# EAGLE design coomu (EAGLE 9.6.2)
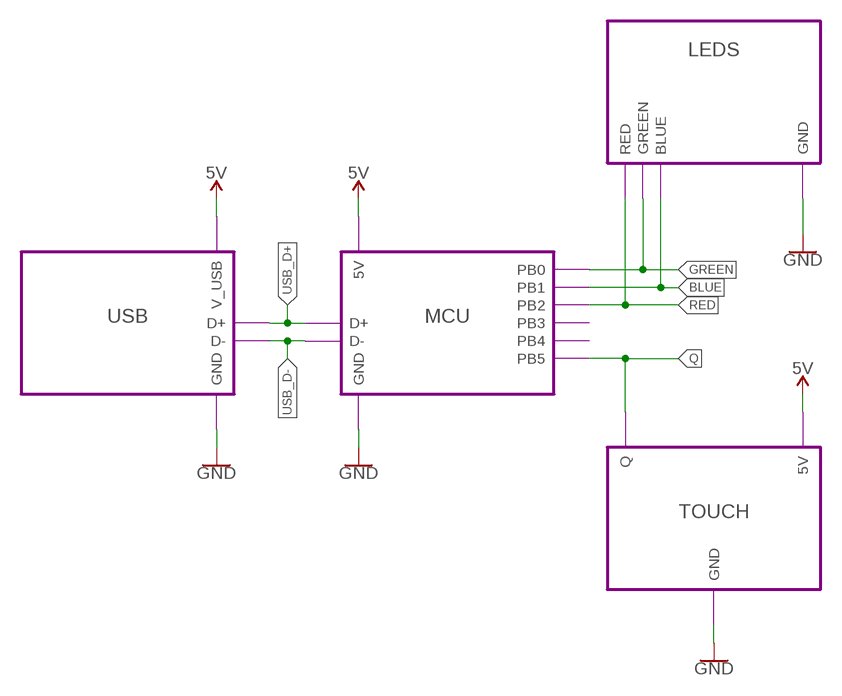
[diagram p0: schematic, sheet 1]

## Module instances
USB = USB
MCU = MCU
LEDS = LEDS
TOUCH = TOUCH

## Nets
5V: port USB.V_USB MCU.5V TOUCH.5V
BLUE: port LEDS.BLUE MCU.PB1
GND: port USB.GND MCU.GND LEDS.GND TOUCH.GND
GREEN: port LEDS.GREEN MCU.PB0
Q: port TOUCH.Q MCU.PB5
RED: port LEDS.RED MCU.PB2
USB_D+: port USB.D+ MCU.D+
USB_D-: port MCU.D- USB.D-

## Library data of the parts

## Module USB
Ports: V_USB(pwr) GND(pwr) D+(io) D-(io)
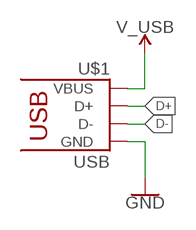
[diagram p1: schematic, module USB, sheet 1]

### Parts
U$1  USB  [USB]

### Nets
D+: U$1.D+
D-: U$1.D-
GND: U$1.GND
V_USB: U$1.VCC(VBUS)

### Library data of the parts
U$1 = coomu:USB

## Module MCU
Ports: D+(io) D-(io) GND(pwr) 5V(pwr) PB0(io) PB1(io) PB2(io) PB3(io) PB4(io) PB5(io)
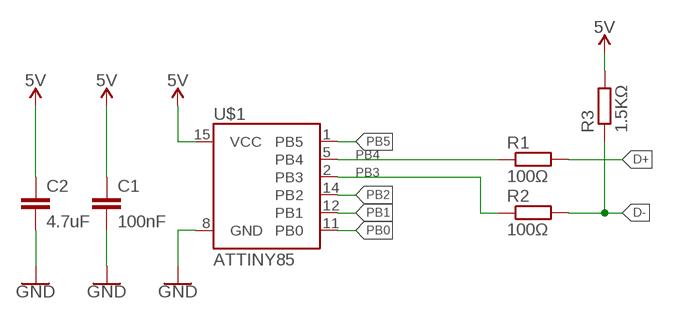
[diagram p2: schematic, module MCU, sheet 1]

### Parts
C1  100nF  100NF-0402-C1525  [CAPACITOR_0402]
C2  4.7uF  4.7UF-0402-C23733  [CAPACITOR_0402]
R1  100Ω  100Ω-0402-C25076  [RESISTOR_0402]
R2  100Ω  100Ω-0402-C25076  [RESISTOR_0402]
R3  1.5KΩ  1.5KΩ-0402-C25867  [RESISTOR_0402]
U$1  ATTINY85  [QFN20]

### Nets
5V: C1.1 C2.1 R3.1 U$1.15(VCC)
D+: R1.1
D-: R2.1 R3.2
GND: C1.2 C2.2 U$1.8(GND)
PB0: U$1.11(PB0)
PB1: U$1.12(PB1)
PB2: U$1.14(PB2)
PB3: R2.2 U$1.2(PB3)
PB4: R1.2 U$1.5(PB4)
PB5: U$1.1(PB5)

### Library data of the parts
C1 = JLCPCB.Capacitors.basic:100NF; JLCPCB_IS_BASIC: yes; LCSC_PART: C1525
C2 = JLCPCB.Capacitors.basic:4.7UF; JLCPCB_IS_BASIC: yes; LCSC_PART: C23733
R1 R2 = JLCPCB.Resistors.basic:100Ω; JLCPCB_IS_BASIC: yes; LCSC_PART: C25076
R3 = JLCPCB.Resistors.basic:1.5KΩ; JLCPCB_IS_BASIC: yes; LCSC_PART: C25867
U$1 = coomu:ATTINY85

## Module LEDS
Ports: RED(in) GREEN(in) BLUE(out) GND(pwr)
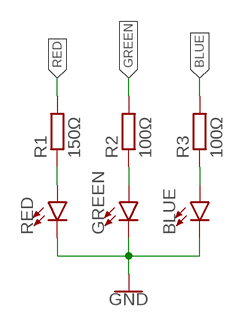
[diagram p3: schematic, module LEDS, sheet 1]

### Parts
BLUE  LED-SIDEFIRE0603  [LED-0603-SIDEFIRE]
GREEN  LED-SIDEFIRE0603  [LED-0603-SIDEFIRE]
R1  150Ω  150Ω-0402-C25082  [RESISTOR_0402]
R2  100Ω  100Ω-0402-C25076  [RESISTOR_0402]
R3  100Ω  100Ω-0402-C25076  [RESISTOR_0402]
RED  LED-SIDEFIRE0603  [LED-0603-SIDEFIRE]

### Nets
BLUE: R3.1
GND: BLUE.P$1(C) GREEN.P$1(C) RED.P$1(C)
GREEN: R2.1
N$1: R1.2 RED.P$2(A)
N$2: GREEN.P$2(A) R2.2
N$3: BLUE.P$2(A) R3.2
RED: R1.1

### Library data of the parts
BLUE GREEN RED = coomu:LED-SIDEFIRE
R1 = JLCPCB.Resistors.basic:150Ω; JLCPCB_IS_BASIC: yes; LCSC_PART: C25082
R2 R3 = JLCPCB.Resistors.basic:100Ω; JLCPCB_IS_BASIC: yes; LCSC_PART: C25076

## Module TOUCH
Ports: Q(out) 5V(pwr) GND(pwr)
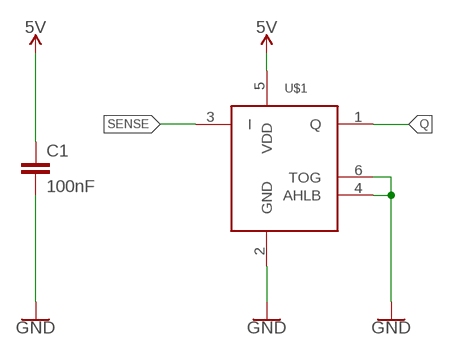
[diagram p4: schematic, module TOUCH, sheet 1]

### Parts
C1  100nF  100NF-0402-C1525  [CAPACITOR_0402]
U$1  TTP223  [SOT23-6]

### Nets
5V: C1.1 U$1.5(VDD)
GND: C1.2 U$1.2(GND) U$1.4(AHLB) U$1.6(TOG)
Q: U$1.1(Q)
SENSE: U$1.3(I)

### Library data of the parts
C1 = JLCPCB.Capacitors.basic:100NF; JLCPCB_IS_BASIC: yes; LCSC_PART: C1525
U$1 = coomu:TTP223

## Board
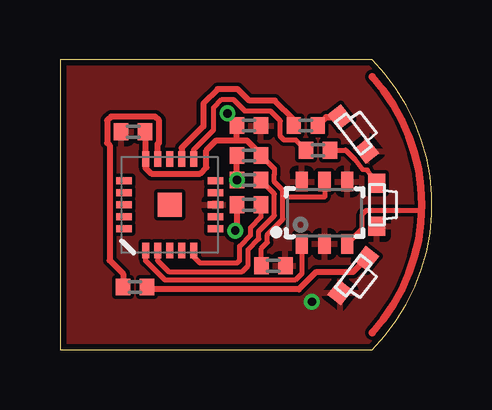
[diagram p5: board, top side]
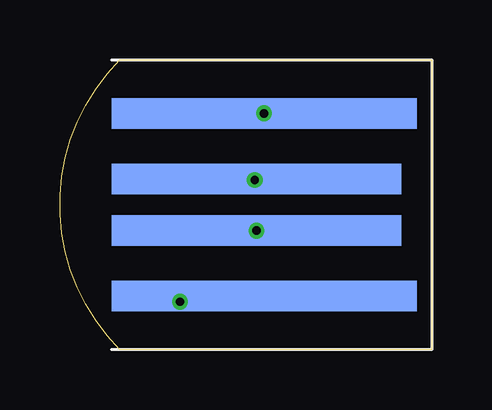
[diagram p6: board, bottom side, seen from below]

Size 15.49 x 12.06 mm. Coordinates in mm from the lower left corner, seen from the top.
Outline: 0,0 13,0 arc90 13,12.06 0,12.06 0,0
Copper layers (1*16): Top 0.035mm / dielectric 1.5mm / Bottom 0.035mm
Design rules "dirtypcbs": minimum track width 6mil, minimum drill 12mil, track to track 6mil, track to pad 6mil, pad to pad 6mil, via to via 6mil, smd to smd 0mil, copper to edge 10mil, drill to drill 10mil, minimum pad ring 10mil, minimum via ring 6mil, stop-mask expansion 2mil, vias tented up to drill 25mil, thermal gap 10mil
tKeepout: area 0,0 to 15.5,12.1

### Footprints (pad centres in the part's own frame; a part is rotated, then mirrored left to right if it is on the bottom)
LED-0603-SIDEFIRE = smd 0.8 x 0.7: P$1 0.9,0; P$2 -0.9,0
RESISTOR_0402 = smd 0.6 x 0.7: 1 -0.5,0; 2 0.5,0
CAPACITOR_0402 = smd 0.6 x 0.7: 1 -0.5,0; 2 0.5,0
QFN20 = smd 1 x 1: 0 0,0 | smd 0.65 x 0.3: 1 -1.9,1; 2 -1.9,0.5; 3 -1.9,0; 4 -1.9,-0.5; 5 -1.9,-1; 11 1.9,-1; 12 1.9,-0.5; 13 1.9,0; 14 1.9,0.5; 15 1.9,1 | smd 0.3 x 0.65: 6 -1,-1.9; 7 -0.5,-1.9; 8 0,-1.9; 9 0.5,-1.9; 10 1,-1.9; 16 1,1.9; 17 0.5,1.9; 18 0,1.9; 19 -0.5,1.9; 20 -1,1.9
SOT23-6 = smd 0.51 x 0.8: 1 -0.95,-1.3; 2 0,-1.3; 3 0.95,-1.3; 4 0.95,1.3; 5 0,1.3; 6 -0.95,1.3
USB = smd 1.27 x 12.065: D+ 1.079,6.032; D- -1.079,6.032 | smd 1.27 x 12.7: GND 3.81,6.35; VCC -3.81,6.35

### Placement (x,y rotation side)
LEDS:BLUE  LED-SIDEFIRE0603  [LED-0603-SIDEFIRE]  12.22,8.98 308 top
LEDS:GREEN  LED-SIDEFIRE0603  [LED-0603-SIDEFIRE]  13.2,6.03 270 top
LEDS:R1  150Ω  [RESISTOR_0402]  3.13,2.6 0 top
LEDS:R2  100Ω  [RESISTOR_0402]  10.75,8.31 0 top
LEDS:R3  100Ω  [RESISTOR_0402]  10.24,9.33 0 top
LEDS:RED  LED-SIDEFIRE0603  [LED-0603-SIDEFIRE]  12.22,3.09 232 top
MCU:C1  100nF  [CAPACITOR_0402]  3.05,9.08 180 top
MCU:C2  4.7uF  [CAPACITOR_0402]  7.87,9.33 0 top
MCU:R1  100Ω  [RESISTOR_0402]  7.87,6.03 0 top
MCU:R2  100Ω  [RESISTOR_0402]  7.87,7.06 0 top
MCU:R3  1.5KΩ  [RESISTOR_0402]  7.87,8.09 180 top
MCU:U$1  ATTINY85  [QFN20]  4.57,6.03 90 top
TOUCH:C1  100nF  [CAPACITOR_0402]  8.89,3.49 0 top
TOUCH:U$1  TTP223  [SOT23-6]  11.02,5.7 0 top
USB:U$1  USB  [USB]  13.34,6.03 270 bottom

### Tracks (layer width: path | path; a pad name or v marks a point on that pad's centre or on a via)
5V  (via drill 0.35)
  Top 0.203: TOUCH:U$1.5 11.02,6.35 9.28,6.35 | 9.28,6.35 9.28,6.64 8.93,6.99 8.93,7.3 8.93,7.54 MCU:R3.1 | TOUCH:C1.1 8.39,4.21 8.64,4.46 8.64,4.79 9.28,5.43 9.28,6.35
  Top 0.254: 3.57,9.08 MCU:U$1.15 3.57,7.56 3.81,7.33 5.84,7.33 6.1,7.59 6.1,8.3 6.51,8.72 7.37,8.72 | USB:U$1.VCC 6.99,9.72 MCU:C2.1 7.37,8.72 | 7.37,8.72 7.79,8.72 8.37,8.14 MCU:R3.1
  Top 0.305: 3.57,9.08 MCU:C1.1
  other vias: 6.99,9.84
BLUE
  Top 0.254: LEDS:R3.1 9.74,9.59 8.96,10.37 7.89,10.37 7.41,10.86 6.57,10.86 5.97,10.26 5.97,9.3 5.07,8.4 MCU:U$1.12
GND  (via drill 0.35)
  Bottom 0.813: 9.27,2.22 | USB:U$1.GND 9.27,2.22 | v10.49,1.99 10.24,2.22 9.27,2.22
  pour Top: -0.76,12.13 16.51,12.13 16.51,-0.06 -0.76,-0.06
GREEN
  Top 0.203: MCU:U$1.11 5.57,8.32 6.4,9.15 6.4,10.08 6.74,10.42 7.23,10.42 7.71,9.94 8.78,9.94 9.19,9.53 9.19,8.88 9.34,8.73 9.84,8.73 LEDS:R2.1
LEDS:N$1
  Top 0.254: LEDS:RED.P$2 12.22,3.24 10.68,3.24 9.95,2.51 3.72,2.51 LEDS:R1.2
LEDS:N$2
  Top 0.203: LEDS:GREEN.P$2 12.8,7.48 12.61,7.5 12.27,7.93 11.9,8.31 LEDS:R2.2
LEDS:N$3
  Top 0.254: LEDS:R3.2 11.09,9.69 LEDS:BLUE.P$2
MCU:PB3
  Top 0.203: 8.4,7.05 8.4,7.01 8.93,6.49 8.93,5.58 8.28,4.93 8.28,4.61 7.84,4.16 7.84,3.49 7.59,3.24 4.53,3.24 4.07,3.7 MCU:U$1.2
  Top 0.254: 8.4,7.05 MCU:R2.2
MCU:PB4
  Top 0.203: MCU:U$1.5 5.57,3.87 5.84,3.6 7.37,3.6 7.48,3.71 7.48,4.31 7.93,4.76 7.93,5.08 8.37,5.53 MCU:R1.2
Q
  Top 0.203: MCU:U$1.1 3.57,3.7 4.38,2.89 9.79,2.89 10.07,3.17 TOUCH:U$1.1
RED
  Top 0.254: MCU:U$1.14 4.07,8.56 4.13,8.61 4.13,9.55 3.96,9.71 2.13,9.71 1.97,9.55 1.97,8.61 2.07,8.52 2.07,3.71 2.63,3.15 LEDS:R1.1
TOUCH:SENSE
  Top 0.203: TOUCH:U$1.3 12.6,5.02 12.6,5.64 12.74,5.79 15.11,5.79 arc-40 13,0.7
  Top 0.305: 13,11.37 arc-85 13,0.7
USB_D+  (via drill 0.35)
  Top 0.254: MCU:R1.1 7.37,5.02 USB:U$1.D+
  Bottom 0.254: USB:U$1.D+ 6.67,4.95 6.6,5.02 7.24,5.02 USB:U$1.D+
  other vias: 7.3,4.95
USB_D-  (via drill 0.35)
  Top 0.254: MCU:R2.1 MCU:R3.2
  Bottom 0.254: USB:U$1.D- MCU:R2.1
  other vias: 7.37,7.06